# Altium schematic sheet POWER_EFUSE.SchDoc
size 420 x 297 mm; SheetNumber: 1; SheetTotal: 20
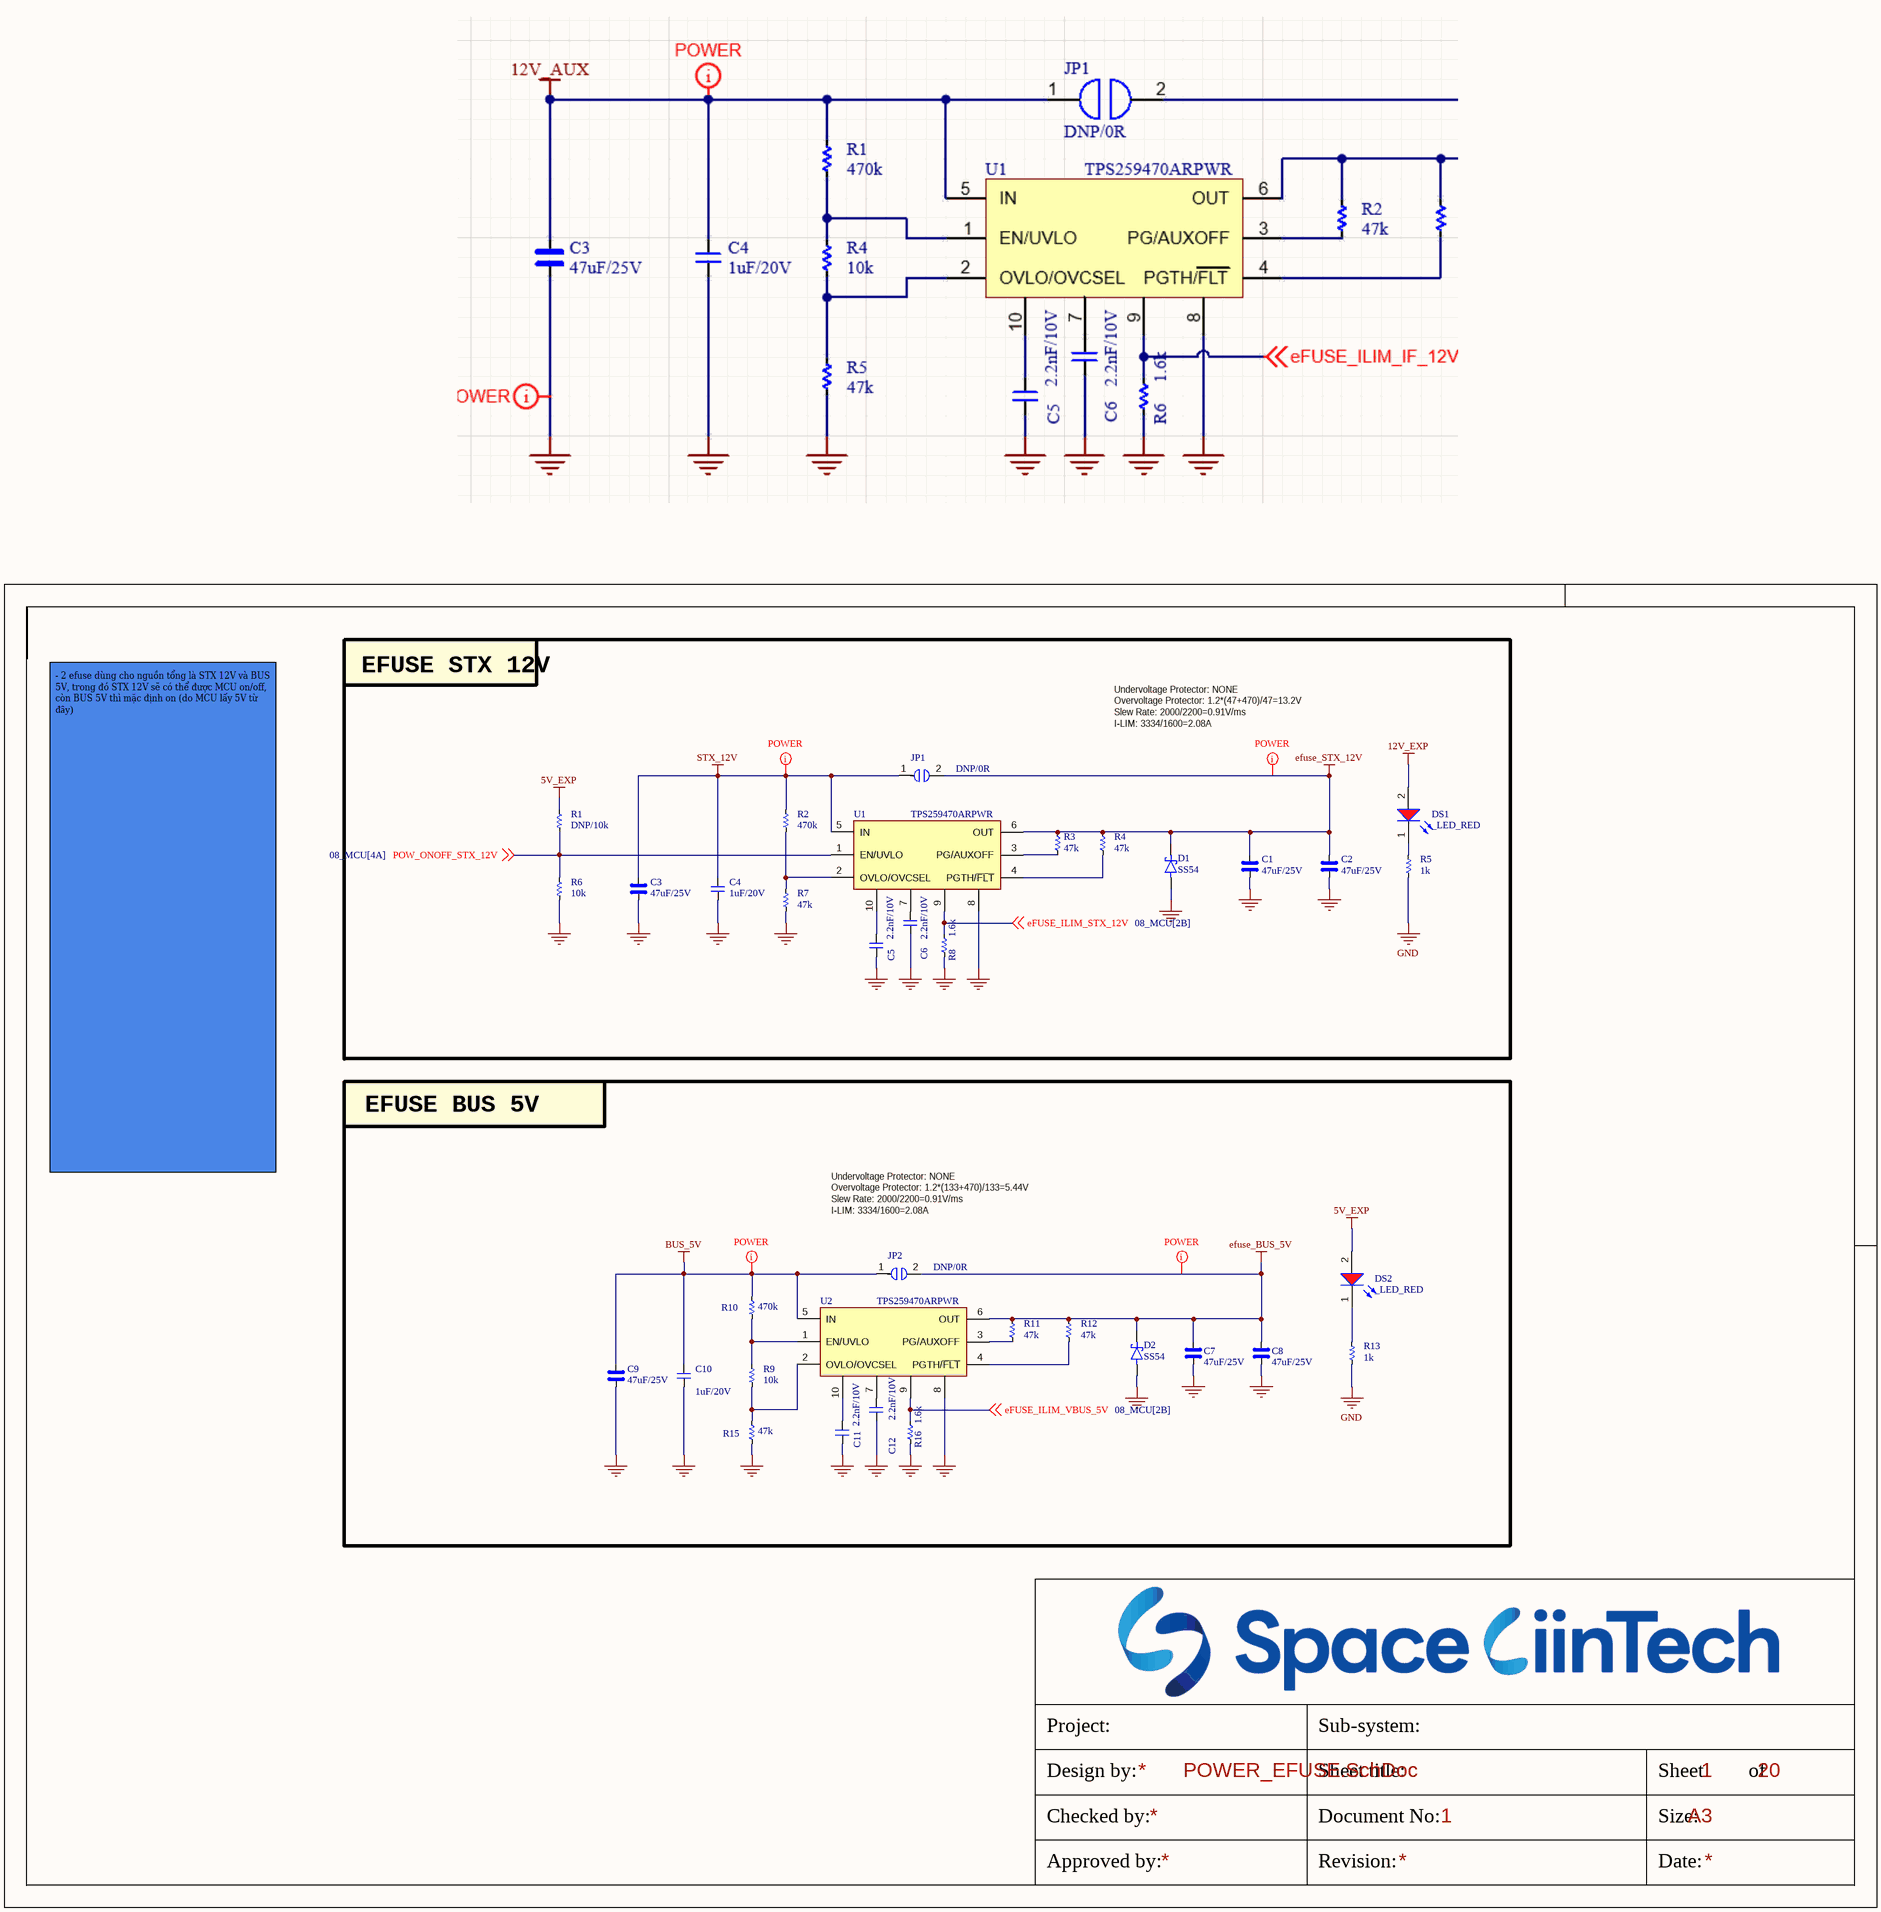
[diagram p0: POWER_EFUSE.SchDoc]

## Parts
C1  47uF/25V  [CAP_C_3225X80]
C2  47uF/25V  [CAP_C_3225X80]
C3  47uF/25V  [CAP_C_3225X80]
C4  1uF/20V  [CAP_C_1005X50_L]
C5  2.2nF/10V  [CAP_C_1005X50_L]
C6  2.2nF/10V  [CAP_C_1005X50_L]
C7  47uF/25V  [CAP_C_3225X80]
C8  47uF/25V  [CAP_C_3225X80]
C9  47uF/25V  [CAP_C_3225X80]
C10  1uF/20V  [CAP_C_1005X50_L]
C11  2.2nF/10V  [CAP_C_1005X50_L]
C12  2.2nF/10V  [CAP_C_1005X50_L]
D1  SS54  [DO-214AC_SMA]
D2  SS54  [DO-214AC_SMA]
DS1  _LED_RED  [LED_0603]
DS2  _LED_RED  [LED_0603]
JP1  DNP/0R  [JUMPER_1608]
JP2  DNP/0R  [JUMPER_1608]
R1  DNP/10k  [RES_C_1005X40]
R2  470k  [RES_C_1005X40]
R3  47k  [RES_C_1005X40]
R4  47k  [RES_C_1005X40]
R5  1k  [RES_C_1005X40]
R6  10k  [RES_C_1005X40]
R7  47k  [RES_C_1005X40]
R8  1.6k  [RES_C_1005X40]
R9  10k  [RES_C_1005X40]
R10  470k  [RES_C_1005X40]
R11  47k  [RES_C_1005X40]
R12  47k  [RES_C_1005X40]
R13  1k  [RES_C_1005X40]
R15  47k  [RES_C_1005X40]
R16  1.6k  [RES_C_1005X40]
U1  TPS259470ARPWR  [VQFN-HR-10]
U2  TPS259470ARPWR  [VQFN-HR-10]

## Blocks framed on the sheet
EFUSE STX 12V: C1-C6 D1 DS1 JP1 R1-R8 U1
EFUSE BUS 5V: C7-C12 D2 DS2 JP2 R9-R13 R15 R16 U2

## Nets
5V_EXP: DS2.2(A) R1.1
12V_EXP: DS1.2(A)
BUS_5V: C9.2 C10.2 JP2.1 R10.2 U2.5(IN)
efuse_BUS_5V: C7.2 C8.2 D2.1(K) JP2.2 R11.2 R12.2 U2.6(OUT)
efuse_STX_12V: C1.2 C2.2 D1.1(K) JP1.2 R3.2 R4.2 U1.6(OUT)
GND: C1.1 C2.1 C3.1 C4.1 C5.1 C6.1 C7.1 C8.1 C9.1 C10.1 C11.1 C12.1 D1.2(A) D2.2(A) R5.1 R6.2 R7.1 R8.1 R13.1 R15.1 R16.1 U1.8 U2.8
STX_12V: C3.2 C4.2 JP1.1 R2.2 U1.5(IN)
eFUSE_ILIM_STX_12V: R8.2 U1.9 ; off-sheet eFUSE_ILIM_STX_12V
eFUSE_ILIM_VBUS_5V: R16.2 U2.9 ; off-sheet eFUSE_ILIM_VBUS_5V
POW_ONOFF_STX_12V: R1.2 R6.1 U1.1(EN/UVLO) ; off-sheet POW_ONOFF_STX_12V
NetC5_2: C5.2 U1.10
NetC6_2: C6.2 U1.7
NetC11_2: C11.2 U2.10
NetC12_2: C12.2 U2.7
NetDS1_1: DS1.1(K) R5.2
NetDS2_1: DS2.1(K) R13.2
NetR2_1: R2.1 R7.2 U1.2(OVLO/OVCSEL)
NetR3_1: R3.1 U1.3(PG/AUXOFF)
NetR4_1: R4.1 U1.4(PGTH/~{FLT})
NetR9_1: R9.1 R15.2 U2.2(OVLO/OVCSEL)
NetR9_2: R9.2 R10.1 U2.1(EN/UVLO)
NetR11_1: R11.1 U2.3(PG/AUXOFF)
NetR12_1: R12.1 U2.4(PGTH/~{FLT})

## Layout directives
net class POWER: BUS_5V, efuse_BUS_5V, efuse_STX_12V, STX_12V

## Notes on the sheet
- Undervoltage Protector: NONE
- Overvoltage Protector: 1.2*(47+470)/47=13.2V
- Slew Rate: 2000/2200=0.91V/ms
- I-LIM: 3334/1600=2.08A
- - 2 efuse dùng cho nguồn tổng là STX 12V và BUS 5V, trong đó STX 12V sẽ có thể được MCU on/off, còn BUS 5V thì mặc định on (do MCU lấy 5V từ đây)
- Overvoltage Protector: 1.2*(133+470)/133=5.44V
- Project:
- Sub-system:
- Design by:
- Sheet title:
- Sheet
- of
- Checked by:
- Approved by:
- Revision:
- Document No:
- Size:
- Date:
- A3

## Library data of the parts
C1-C3 C7-C9 = _CAP_C_High_2: CAP High Value
C4-C6 C10-C12 = _CAP_C_2: CAP
D1 D2 = DIODE SCHOTTKY
JP1 JP2 = JUMPER_1_1
R1-R13 R15 R16 = _RES_B_2: RES